# EAGLE design sparkfun_esp32_environment_sensor_shield (EAGLE 7.7.0)
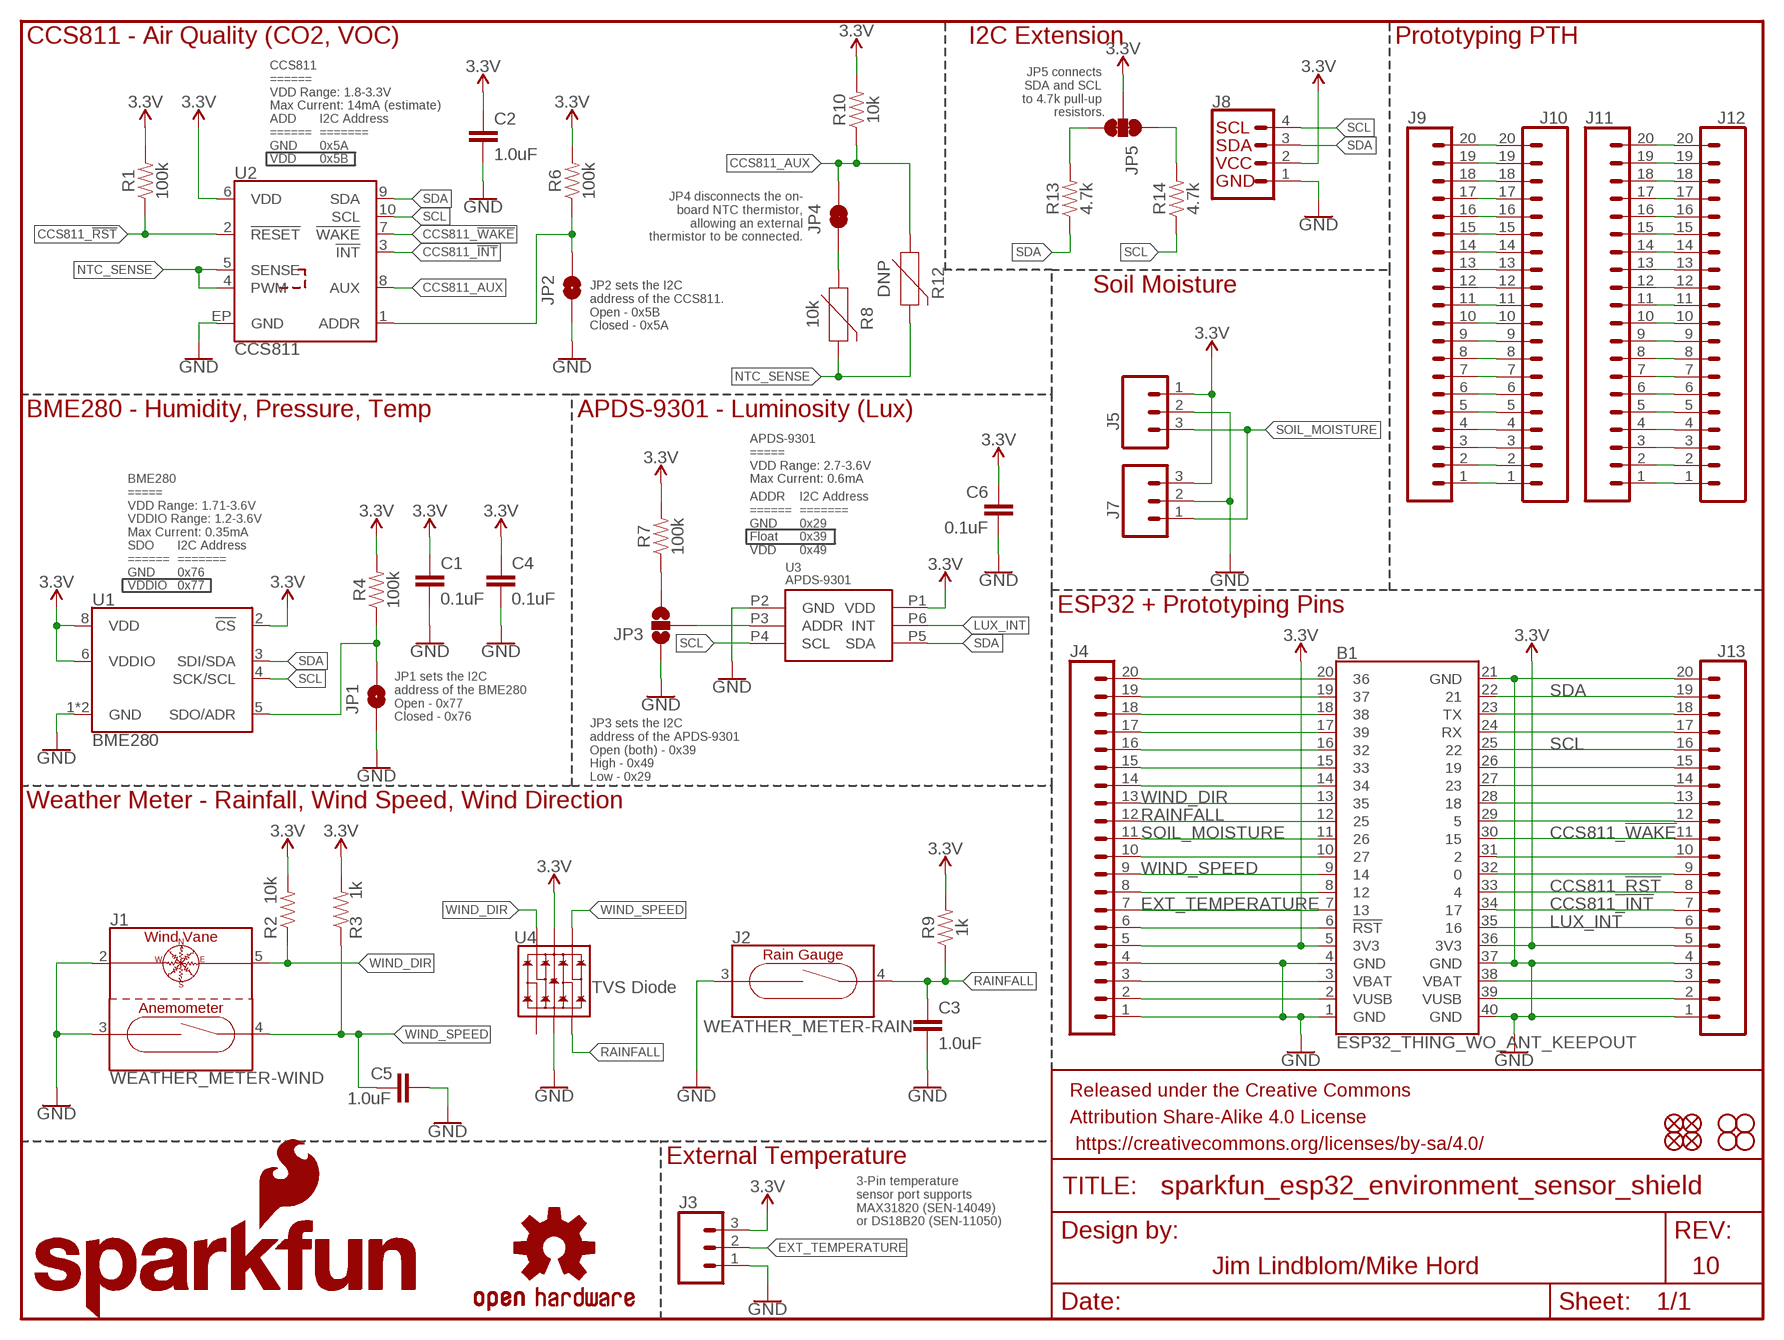
[diagram p0: schematic, sheet 1]

## Parts
B1  ESP32_THING_WO_ANT_KEEPOUT  [ESP32_THING_NO_ANT]
C1  0.1uF  0.1UF-0603-25V-(+80/-20%)  [0603]
C2  1.0uF  1.0UF-0603-16V-10%  [0603]
C3  1.0uF  1.0UF-0603-16V-10%  [0603]
C4  0.1uF  0.1UF-0603-25V-(+80/-20%)  [0603]
C5  1.0uF  1.0UF-0603-16V-10%  [0603]
C6  0.1uF  0.1UF-0603-25V-(+80/-20%)  [0603]
FD1  FIDUCIAL1X2  [FIDUCIAL-1X2]
FD2  FIDUCIAL1X2  [FIDUCIAL-1X2]
FD3  FIDUCIAL1X2  [FIDUCIAL-1X2]
FD4  FIDUCIAL1X2  [FIDUCIAL-1X2]
FRAME1  FRAME-LETTER  [CREATIVE_COMMONS]
H1  STAND-OFF  [STAND-OFF]
H2  STAND-OFF  [STAND-OFF]
H3  STAND-OFF  [STAND-OFF]
H4  STAND-OFF  [STAND-OFF]
J1  WEATHER_METER-WIND  [RJ11-6]
J2  WEATHER_METER-RAIN  [RJ11-6]
J3  CONN_03  [1X03]
J4  CONN_20NOSILK  [1X20_NOSILK]
J5  CONN_03  [1X03]
J7  CONN_03SCREW-NS  [SCREWTERMINAL-3.5MM-3-NS]
J8  I2C_STANDARD  [1X04]
J9  CONN_20NOSILK  [1X20_NOSILK]
J10  CONN_20NOSILK  [1X20_NOSILK]
J11  CONN_20NOSILK  [1X20_NOSILK]
J12  CONN_20NOSILK  [1X20_NOSILK]
J13  CONN_20NOSILK  [1X20_NOSILK]
JP1  JUMPER-SMT_2_NO_SILK  [SMT-JUMPER_2_NO_SILK]
JP2  JUMPER-SMT_2_NO_SILK  [SMT-JUMPER_2_NO_SILK]
JP3  JUMPER-SMT_3_NO_SILK  [SMT-JUMPER_3_NO_SILK]
JP4  JUMPER-SMT_2_NC_TRACE_SILK  [SMT-JUMPER_2_NC_TRACE_SILK]
JP5  JUMPER-SMT_3_2-NC_TRACE_SILK  [SMT-JUMPER_3_2-NC_TRACE_SILK]
LOGO1  SFE_LOGO_NAME.1_INCH  [SFE_LOGO_NAME_.1]
LOGO2  SFE_LOGO_NAME_FLAME.1_INCH  [SFE_LOGO_NAME_FLAME_.1]
LOGO3  SFE_LOGO_FLAME.1_INCH  [SFE_LOGO_FLAME_.1]
LOGO4  OSHW-LOGOS  [OSHW-LOGO-S]
R1  100k  100KOHM-0603-1/10W-1%  [0603]
R2  10k  10KOHM-0603-1/10W-1%  [0603]
R3  1k  1KOHM-0603-1/10W-1%  [0603]
R4  100k  100KOHM-0603-1/10W-1%  [0603]
R6  100k  100KOHM-0603-1/10W-1%  [0603]
R7  100k  100KOHM-0603-1/10W-1%  [0603]
R8  10k  NTC-THERMISTOR-0603  [0603]
R9  1k  1KOHM-0603-1/10W-1%  [0603]
R10  10k  10KOHM-0603-1/10W-1%  [0603]
R12  DNP  NTC-THERMISTOR-AXIAL-0.1  [AXIAL-0.1]
R13  4.7k  4.7KOHM-0603-1/10W-1%  [0603]
R14  4.7k  4.7KOHM-0603-1/10W-1%  [0603]
U1  BME280  [LGA-8-2.5X2.5]
U2  CCS811  [LGA10-2.7X4.0MM]
U3  APDS-9301  [CHIPLED-6]
U4  TVS Diode  TVS_DIODE_ARRAYSMD  [SOT-23-6]

## Nets
3.3V: B1.5(3V3) B1.36(3V3) C1.1 C2.1 C4.1 C6.1 J3.3 J4.5 J5.1 J7.3 J8.2 J13.5 JP5.2 R1.2 R2.2 R3.2 R4.2 R6.2 R7.2 R9.2 R10.2 U1.2(!CS) U1.6(VDDIO) U1.8(VDD) U2.6(VDD) U3.P1(VDD) U4.5(VCC)
ADDR_TSL2561: JP3.2 U3.P3(ADDR)
CCS811_!INT!: B1.34 J13.7 U2.3(!INT!)
CCS811_!RST!: B1.33 J13.8 R1.1 U2.2(!RESET!)
CCS811_!WAKE!: B1.30 J13.11 U2.7(!WAKE!)
CCS811_ADDR: JP2.2 R6.1 U2.1(ADDR)
CCS811_AUX: JP4.2 R10.1 R12.P$1 U2.8(AUX)
EXT_TEMPERATURE: B1.7 J3.2 J4.7
GND: B1.1(GND) B1.4(GND) B1.21(GND) B1.37(GND) B1.40(GND) C1.2 C2.2 C3.2 C4.2 C5.2 C6.2 J1.2(DIR-1) J1.3(ANN-1) J2.3 J3.1 J4.1 J4.4 J5.2 J7.2 J8.1 J13.1 J13.4 J13.20 JP1.1 JP2.1 JP3.1 U1.1(GND) U1.7(GND) U2.EP(GND) U3.P2(GND) U4.2(VSS)
LUX_INT: B1.35 J13.6 U3.P6(INT)
N$1: JP3.3 R7.1
N$2: JP1.2 R4.1 U1.5(SDO/ADR)
N$3: JP4.1 R8.1
N$4: JP5.3 R13.2
N$5: JP5.1 R14.2
N$6: B1.2(VUSB) J4.2
N$7: B1.3(VBAT) J4.3
N$8: B1.6(!RST!) J4.6
N$9: B1.10 J4.10
N$11: B1.14 J4.14
N$12: B1.15 J4.15
N$13: B1.16 J4.16
N$14: B1.17 J4.17
N$15: B1.18 J4.18
N$16: B1.19 J4.19
N$17: B1.20 J4.20
N$18: B1.39(VUSB) J13.2
N$19: B1.38(VBAT) J13.3
N$20: B1.32 J13.9
N$21: B1.31 J13.10
N$22: B1.8 J4.8
N$23: B1.29 J13.12
N$24: B1.28 J13.13
N$25: B1.27 J13.14
N$26: B1.26 J13.15
N$27: B1.24(RX) J13.17
N$28: B1.23(TX) J13.18
N$29: J11.1 J12.1
N$30: J11.2 J12.2
N$31: J11.3 J12.3
N$32: J11.4 J12.4
N$33: J11.5 J12.5
N$34: J11.6 J12.6
N$35: J11.7 J12.7
N$36: J11.8 J12.8
N$37: J11.9 J12.9
N$38: J11.10 J12.10
N$39: J11.11 J12.11
N$40: J11.12 J12.12
N$41: J11.13 J12.13
N$42: J11.14 J12.14
N$43: J11.15 J12.15
N$44: J11.16 J12.16
N$45: J11.17 J12.17
N$46: J11.18 J12.18
N$47: J11.19 J12.19
N$48: J11.20 J12.20
N$49: J9.1 J10.1
N$50: J9.2 J10.2
N$51: J9.3 J10.3
N$52: J9.4 J10.4
N$53: J9.5 J10.5
N$54: J9.6 J10.6
N$55: J9.7 J10.7
N$56: J9.8 J10.8
N$57: J9.9 J10.9
N$58: J9.10 J10.10
N$59: J9.11 J10.11
N$60: J9.12 J10.12
N$61: J9.13 J10.13
N$62: J9.14 J10.14
N$63: J9.15 J10.15
N$64: J9.16 J10.16
N$65: J9.17 J10.17
N$66: J9.18 J10.18
N$67: J9.19 J10.19
N$68: J9.20 J10.20
NTC_SENSE: R8.2 R12.P$2 U2.4(PWM) U2.5(SENSE)
RAINFALL: B1.12 C3.1 J2.4 J4.12 R9.1 U4.3(IO2)
SCL: B1.25 J8.4 J13.16 R14.1 U1.4(SCK/SCL) U2.10(SCL) U3.P4(SCL)
SDA: B1.22 J8.3 J13.19 R13.1 U1.3(SDI/SDA) U2.9(SDA) U3.P5(SDA)
SOIL_MOISTURE: B1.11 J4.11 J5.3 J7.1
WIND_DIR: B1.13 J1.5(DIR2) J4.13 R2.1 U4.6(IO4)
WIND_SPEED: B1.9 C5.1 J1.4(ANN-2) J4.9 R3.1 U4.4(IO3)
Unconnected: U4.1(IO1)

## Notes on the sheet
- CCS811 - Air Quality (CO2, VOC) | I2C Extension | Prototyping PTH
- JP5 connects 
  SDA and SCL 
  to 4.7k pull-up 
  resistors.
- CCS811
  ======
  VDD Range: 1.8-3.3V
  Max Current: 14mA (estimate)
- ADD
  ======
  GND
  VDD
- I2C Address
  =======
  0x5A
  0x5B
- JP4 disconnects the on-
  board NTC thermistor,
  allowing an external
  thermistor to be connected.
- Soil Moisture
- JP2 sets the I2C 
  address of the CCS811.
  Open - 0x5B
  Closed - 0x5A
- BME280 - Humidity, Pressure, Temp | APDS-9301 - Luminosity (Lux)
- APDS-9301
  =====
  VDD Range: 2.7-3.6V
  Max Current: 0.6mA
- BME280
  =====
  VDD Range: 1.71-3.6V
  VDDIO Range: 1.2-3.6V
  Max Current: 0.35mA
- ADDR
  ======
  GND
  Float
  VDD
- I2C Address
  =======
  0x29
  0x39
  0x49
- SDO
  ======
  GND
  VDDIO
- I2C Address
  =======
  0x76
  0x77
- ESP32 + Prototyping Pins
- JP1 sets the I2C 
  address of the BME280
  Open - 0x77
  Closed - 0x76
- JP3 sets the I2C 
  address of the APDS-9301
  Open (both) - 0x39
  High - 0x49
  Low - 0x29
- Weather Meter - Rainfall, Wind Speed, Wind Direction
- External Temperature
- 3-Pin temperature 
  sensor port supports
  MAX31820 (SEN-14049)
  or DS18B20 (SEN-11050)
- Jim Lindblom/Mike Hord | 10

## Library data of the parts
B1 = SparkFun-Boards:ESP32_THING: SparkFun ESP32 Thing Board Pins, silkscreen, and logos matching the layout of the SparkFun ESP32 Thing <https://www.sparkfun.com/products/13907> Dimensions: 2.32" x 1.00"
C1 C4 C6 = SparkFun-Capacitors:0.1UF: 0.1µF ceramic capacitors A capacitor is a passive two-terminal electrical component used to store electrical energy temporarily in an electric field.; PROD_ID: CAP-00810
C2 C3 C5 = SparkFun-Capacitors:1.0UF: 1µF ceramic capacitors A capacitor is a passive two-terminal electrical component used to store electrical energy temporarily in an electric field.; PROD_ID: CAP-00868
FD1-FD4 = SparkFun-Aesthetics:FIDUCIAL: Fiducial Alignment Points Point-of-reference for pick-and-place machines and other optical instruments.
FRAME1 = SparkFun-Aesthetics:FRAME-LETTER: Schematic Frame - Letter Standard 8.5x11 US Letter frame
H1-H4 = SparkFun-Hardware:STAND-OFF: Stand Off Drill holes for mechanically mounting via screws, standoffs, etc. Note: Use the keepout ring to avoid running the screw head into surrounding components. Variant Overviews STAND-OFF - Mechanical footprint for a #4 phillips button head screw. STAND-OFF-TIGHT - Mechanical footprint for a #4 phillips button head screw, Example SparkFun Products Screw - Phillips Head (1/4", 4-40, 10 pack) <https://www.sparkfun.com/products/10453> (PRT-10453) Screw - Phillips Head (1/2", 4-40, 10 pack) <https://www.sparkfun.com/products/10452> (PRT-10452) Screw - Phillips Head (3/4", 4-40, 10 pack) <https://www.sparkfun.com/products/10451> (PRT-10451) Screw - Phillips Head (1", 4-40, 10 pack) <https://www.sparkfun.com/products/10450> (PRT-10450)
J1 = esp32-environ-monitor-temp:WEATHER_METER-WIND: RJ11 Jack - 6 pin Commonly found on CAT3 devices and some Microchip programmers. Here is the connector we sell at SparkFun: RJ11 6-Pin Connector <https://www.sparkfun.com/products/132> (PRT-00132) Datasheet <http://www.sparkfun.com/datasheets/Prototyping/Connectors/RJ11-Datasheet.pdf> It is used on this SparkFun product: SparkFun Weather Shield <https://www.sparkfun.com/products/12081> (DEV-12081) Weather Meters <https://www.sparkfun.com/products/8942> (SEN-08942); PROD_ID: CONN-08590; SF_ID: PRT-00132
J2 = esp32-environ-monitor-temp:WEATHER_METER-RAIN: Weather Meter - Rain Gauge Symbol The rain half of the SparkFun Weather Meter <https://www.sparkfun.com/products/8942>. The rain gauge is a self-emptying tipping bucket type. Each 0.011” (0.2794 mm) of rain causes one momentary contact closure that can be recorded with a digital counter or microcontroller interrupt input. The gauge’s switch is connected to the two center conductors of the attached RJ11-terminated cable. Datasheet <http://www.sparkfun.com/datasheets/Sensors/Weather/Weather%20Sensor%20Assembly..pdf> Here is the connector we sell at SparkFun: RJ11 6-Pin Connector <https://www.sparkfun.com/products/132> (PRT-00132) Datasheet <http://www.sparkfun.com/datasheets/Prototyping/Connectors/RJ11-Datasheet.pdf> It is used on this SparkFun product: SparkFun Weather Shield <https://www.sparkfun.com/products/12081> (DEV-12081) Weather Meters <https://www.sparkfun.com/products/8942> (SEN-08942); PROD_ID: CONN-08590; SF_ID: SEN-08942
J3 J5 J7 = SparkFun-Connectors:CONN_03: Multi connection point. Often used as Generic Header-pin footprint for 0.1 inch spaced/style header connections On any of the 0.1 inch spaced packages, you can populate with these: Break Away Headers - Straight <https://www.sparkfun.com/products/116> (PRT-00116) Break Away Male Headers - Right Angle <https://www.sparkfun.com/products/553> (PRT-00553) Female Headers <https://www.sparkfun.com/products/115> (PRT-00115) Break Away Headers - Machine Pin <https://www.sparkfun.com/products/117> (PRT-00117) Break Away Female Headers - Swiss Machine Pin <https://www.sparkfun.com/products/743> (PRT-00743) Stackable Header - 3 Pin (Female, 0.1") <https://www.sparkfun.com/products/13875> (PRT-13875) For SCREWTERMINALS and SPRING TERMINALS visit here: Screw Terimnals on SparkFun.com <https://www.sparkfun.com/search/results?term=Screw+Terminals> (5mm/3.5mm/2.54mm spacing) This device is also useful as a general connection point to wire up your design to another part of your project. Our various solder wires solder well into these plated through hole pads. Hook-Up Wire - Assortment (Stranded, 22 AWG) <https://www.sparkfun.com/products/11375> (PRT-11375) Hook-Up Wire - Assortment (Solid Core, 22 AWG) <https://www.sparkfun.com/products/11367> (PRT-11367) View the entire wire category on our website here <https://www.sparkfun.com/categories/141> Special notes: Molex polarized connector foot print use with SKU : PRT-08232 with associated crimp pins and housings.
J4 J9-J13 = SparkFun-Connectors:CONN_20: Multi connection point. Often used as Generic Header-pin footprint for 0.1 inch spaced/style header connections On any of the 0.1 inch spaced packages, you can populate with these: Break Away Headers - Straight <https://www.sparkfun.com/products/116> (PRT-00116) Break Away Male Headers - Right Angle <https://www.sparkfun.com/products/553> (PRT-00553) Female Headers <https://www.sparkfun.com/products/115> (PRT-00115) Break Away Headers - Machine Pin <https://www.sparkfun.com/products/117> (PRT-00117) Break Away Female Headers - Swiss Machine Pin <https://www.sparkfun.com/products/743> (PRT-00743) For SCREWTERMINALS and SPRING TERMINALS visit here: Screw Terimnals on SparkFun.com <https://www.sparkfun.com/search/results?term=Screw+Terminals> (5mm/3.5mm/2.54mm spacing) This device is also useful as a general connection point to wire up your design to another part of your project. Our various solder wires solder well into these plated through hole pads. Hook-Up Wire - Assortment (Stranded, 22 AWG) <https://www.sparkfun.com/products/11375> (PRT-11375) Hook-Up Wire - Assortment (Solid Core, 22 AWG) <https://www.sparkfun.com/products/11367> (PRT-11367) View the entire wire category on our website here <https://www.sparkfun.com/categories/141> Special notes: Molex polarized connector foot print use with SKU : PRT-08231 with associated crimp pins and housings. 1MM SMD Version SKU: PRT-10208 NOTES ON THE VARIANTS LOCK and LOCK_LONGPADS... This footprint was designed to help hold the alignment of a through-hole component (i.e. 6-pin header) while soldering it into place. You may notice that each hole has been shifted either up or down by 0.005 of an inch from it's more standard position (which is a perfectly straight line). This slight alteration caused the pins (the squares in the middle) to touch the edges of the holes. Because they are alternating, it causes a "brace" to hold the component in place. 0.005 has proven to be the perfect amount of "off-center" position when using our standard breakaway headers. Although looks a little odd when you look at the bare footprint, once you have a header in there, the alteration is very hard to notice. Also,if you push a header all the way into place, it is covered up entirely on the bottom side. Note about LOCK SPECIAL package: This is just like the LOCK variant in that the holes are staggared by 5 mil, but except for the last two holes. They are not altered from the "standard" footprint layout. This is used for a special purpose on the layout of our Graphic LCD Backpack. Make sure you want to use this device before selecting it for you project!
J8 = SparkFun-Connectors:I2C_STANDARD: SparkFun I2C Standard Pinout Header SparkFun has standardized on a pinout for all I2C based sensor breakouts. This pinout allows I2C boards to be plugged directly into the headers on Arduino Uno compatible boards, and to be daisy chained easily. Example SparkFun Products: SparkFun Atmospheric Sensor Breakout - BME280 <https://www.sparkfun.com/products/13676> SparkFun Altitude/Pressure Sensor Breakout - MPL3115A2 <https://www.sparkfun.com/products/11084> SparkFun TOF Range Finder Sensor - VL6180 <https://www.sparkfun.com/products/12785>
JP1 JP2 = SparkFun-Jumpers:JUMPER-SMT_2_NO: Normally open jumper This jumper has two pads in close proximity to each other. Apply solder to close the connection. Round pads are easier to solder for beginners, but are a lot larger. SparkFun Product that uses the round pads: SparkFun EL Sequencer <https://www.sparkfun.com/products/12781>
JP3 = SparkFun-Jumpers:JUMPER-SMT_3_NO: Normally open jumper This jumper has three pads in close proximity to each other. Apply solder to close the connection(s).
JP4 = SparkFun-Jumpers:JUMPER-SMT_2_NC_TRACE: Normally closed trace jumper This jumper has a trace between two pads so it's normally closed (NC). Use a razor knife to open the connection. For best results follow the IPC guidelines for cutting traces: Cutout at least 0.063 mm (0.005 in). Remove all loose material to clean up the cut area. Seal the cut with an approved epoxy. Reapply solder to reclose the connection.
JP5 = SparkFun-Jumpers:JUMPER-SMT_3_2-NC_TRACE: Normally closed trace jumper (2 of 2 connections) This jumper has a trace between all three pads so they are normally closed (NC). Use a razor knife to open the connection(s). For best results follow the IPC guidelines for cutting traces: Cutout at least 0.063 mm (0.005 in). Remove all loose material to clean up the cut area. Seal the cut with an approved epoxy. Reapply solder to reclose the connection(s).
LOGO1 = SparkFun-Aesthetics:SFE_LOGO_NAME: SparkFun Font Logo This is the SparkFun name logo. The logo on the schematic will always be the same size; the package variant is the height of the flame part of the logo (or the height the flame would be, if it were drawn). Default layer for the logo on the board is tSilk.
LOGO2 = SparkFun-Aesthetics:SFE_LOGO_NAME_FLAME: SparkFun Font Logo w/ Flame This is the SparkFun full logo. The logo on the schematic will always be the same size; the package variant is the height of the flame part of the logo. Default layer for the logo on the board is tSilk.
LOGO3 = SparkFun-Aesthetics:SFE_LOGO_FLAME: SparkFun Flame Logo This is the SparkFun flame logo. The logo on the schematic will always be the same size; the package variant is the height of the flame. Default layer for the logo on the board is tSilk.
LOGO4 = SparkFun-Aesthetics:OSHW-LOGO: Open-Source Hardware (OSHW) Logo This logo indicates the piece of hardware it is found on incorporates a OSHW license and/or adheres to the definition of open source hardware found here: http://freedomdefined.org/OSHW
R1 R4 R6 R7 = SparkFun-Resistors:100KOHM: 100kΩ resistor A resistor is a passive two-terminal electrical component that implements electrical resistance as a circuit element. Resistors act to reduce current flow, and, at the same time, act to lower voltage levels within circuits. - Wikipedia; PROD_ID: RES-07828
R2 R10 = SparkFun-Resistors:10KOHM: 10kΩ resistor A resistor is a passive two-terminal electrical component that implements electrical resistance as a circuit element. Resistors act to reduce current flow, and, at the same time, act to lower voltage levels within circuits. - Wikipedia; PROD_ID: RES-00824
R3 R9 = SparkFun-Resistors:1KOHM: 1kΩ resistor A resistor is a passive two-terminal electrical component that implements electrical resistance as a circuit element. Resistors act to reduce current flow, and, at the same time, act to lower voltage levels within circuits. - Wikipedia; PROD_ID: RES-07856
R8 = esp32-environ-monitor-temp:NTC-THERMISTOR: NTC Thermistor An NTC thermistor's resistance decreases as temperature rises. Applications: Resistance Thermometer - temperature monitoring Inrush current limiter Heat source; PROD_ID: RES-13608
R12 = esp32-environ-monitor-temp:NTC-THERMISTOR: NTC Thermistor An NTC thermistor's resistance decreases as temperature rises. Applications: Resistance Thermometer - temperature monitoring Inrush current limiter Heat source; SF_ID: SEN-00250; VALUE: 10k
R13 R14 = SparkFun-Resistors:4.7KOHM: 4.7kΩ resistor A resistor is a passive two-terminal electrical component that implements electrical resistance as a circuit element. Resistors act to reduce current flow, and, at the same time, act to lower voltage levels within circuits. - Wikipedia; PROD_ID: RES-07857
U1 = SparkFun-Sensors:BME280: Bosch BME280 – Combined Humidity and Pressure Sensor The BME280 is as combined digital humidity, pressure and temperature sensor based on proven sensing principles. The sensor module is housed in an extremely compact metal-lid LGA package with a footprint of only 2.5×2.5mm² with a height of 0.93mm. Its small dimensions and its low power consumption allow the implementation in battery driven devices such as handsets, GPS modules or watches. Datasheet <https://cdn.sparkfun.com/assets/learn_tutorials/4/1/9/BST-BME280_DS001-10.pdf> SparkFun Products SparkFun Atmospheric Sensor Breakout - BME280 <https://www.sparkfun.com/products/13676> (SEN-13676); PROD_ID: IC-13090
U2 = esp32-environ-monitor-temp:CCS811: AMS CCS811 – I2C Digital Gas Sensor Ultra-Low Power Digital Gas Sensor for Monitoring Indoor Air Quality AMS Product Page <http://ams.com/eng/Products/Environmental-Sensors/Gas-Sensors/CCS811> SparkFun Products:; PROD_ID: IC-13607
U3 = SparkFun-Sensors:APDS-9301; PROD_ID: IC-13662
U4 = esp32-environ-monitor-temp:TVS_DIODE_ARRAY; PROD_ID: IC-13538; VALUE: ESD Diode

## Board
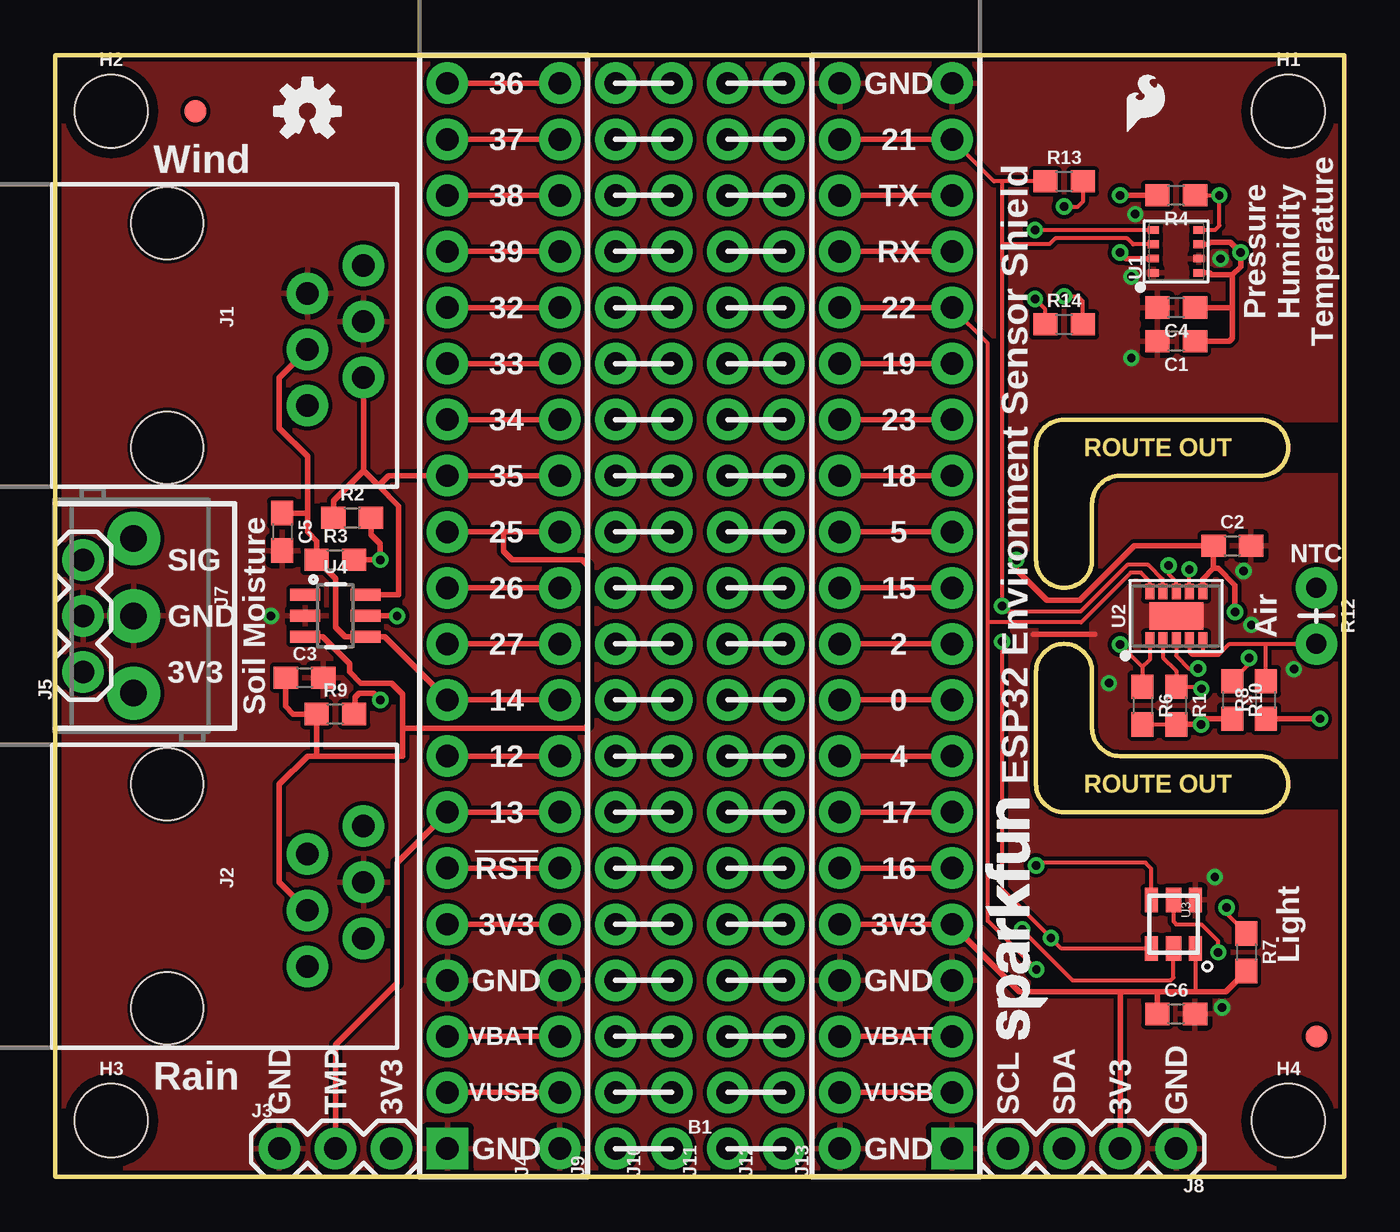
[diagram p1: board, top side]
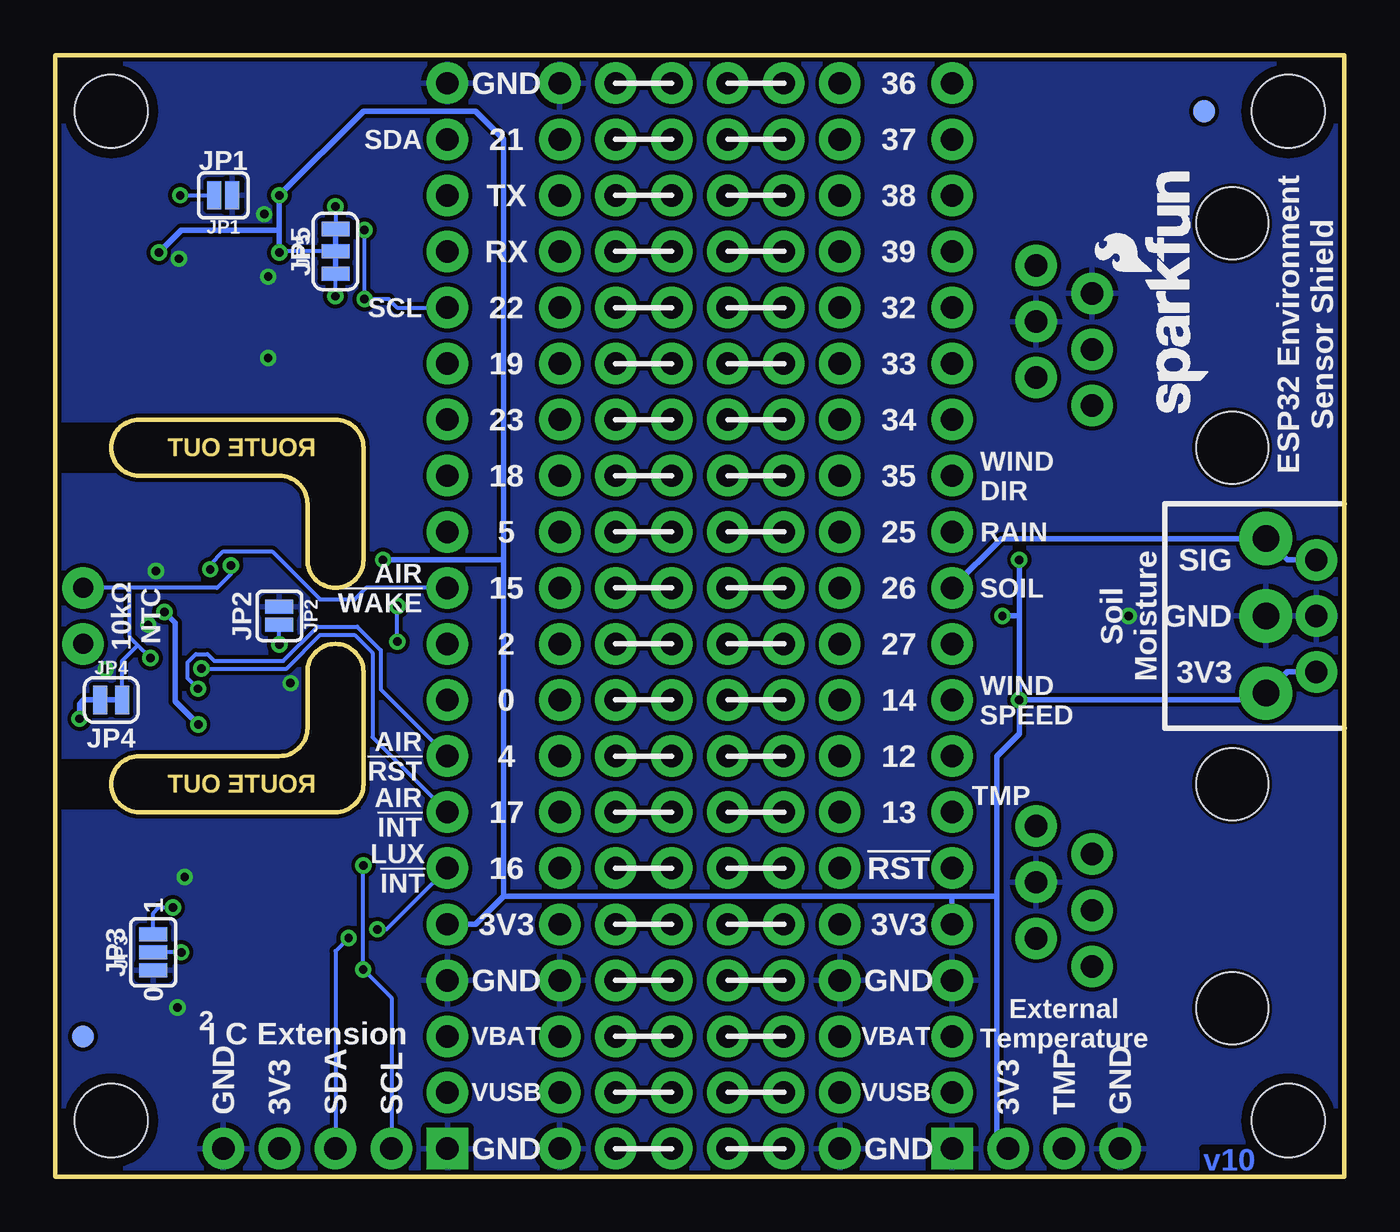
[diagram p2: board, bottom side, seen from below]

Size 58.42 x 50.8 mm. Coordinates in mm from the lower left corner, seen from the top.
Outline: 0,0 0,50.8 58.42,50.8 58.42,0 0,0
Outline: 45.72,34.29 arc90 44.45,33.02 44.45,27.94 arc90 45.72,26.67 arc90 46.99,27.94 46.99,30.48 arc-90 48.26,31.75 54.61,31.75 arc90 55.88,33.02 arc90 54.61,34.29 45.72,34.29
Outline: 44.45,17.78 arc90 45.72,16.51 54.61,16.51 arc90 55.88,17.78 arc90 54.61,19.05 48.26,19.05 arc-90 46.99,20.32 46.99,22.86 arc90 45.72,24.13 arc90 44.45,22.86 44.45,17.78
Copper layers (1*16): Top 0.035mm / dielectric 1.5mm / Bottom 0.035mm
Design rules "SparkFun-2-layer-TIGHT": minimum track width 7mil, minimum drill 15mil, track to track 7mil, track to pad 7mil, pad to pad 7mil, via to via 7mil, smd to smd 7mil, copper to edge 7mil, drill to drill 7mil, minimum pad ring 7mil, minimum via ring 7mil, stop-mask expansion 4mil, vias tented up to drill 25mil, thermal gap 10mil
Milling: area 44.5,26.7 to 55.9,34.3; area 44.5,16.5 to 55.9,24.1

### Footprints (pad centres in the part's own frame; a part is rotated, then mirrored left to right if it is on the bottom)
ESP32_THING_NO_ANT = drill 1.016 pad 1.88 square: 1 1.27,1.27; 40 24.13,1.27 | drill 1.016 pad 1.88: 2 1.27,3.81; 3 1.27,6.35; 4 1.27,8.89; 5 1.27,11.43; 6 1.27,13.97; 7 1.27,16.51; 8 1.27,19.05; 9 1.27,21.59; 10 1.27,24.13; 11 1.27,26.67; 12 1.27,29.21; 13 1.27,31.75; 14 1.27,34.29; 15 1.27,36.83; 16 1.27,39.37; 17 1.27,41.91; 18 1.27,44.45; 19 1.27,46.99; 20 1.27,49.53; 21 24.13,49.53; 22 24.13,46.99; 23 24.13,44.45; 24 24.13,41.91; 25 24.13,39.37; 26 24.13,36.83; 27 24.13,34.29; 28 24.13,31.75; 29 24.13,29.21; 30 24.13,26.67; 31 24.13,24.13; 32 24.13,21.59; 33 24.13,19.05; 34 24.13,16.51; 35 24.13,13.97; 36 24.13,11.43; 37 24.13,8.89; 38 24.13,6.35; 39 24.13,3.81
0603 = smd 1.1 x 1: 1 -0.85,0; 2 0.85,0
FIDUCIAL-1X2 = smd 1 x 1: 1 0,0
STAND-OFF = hole 3.302: 0,0
RJ11-6 = drill 1.016 pad 1.88: 1 -3.175,8.89; 2 -1.905,6.35; 3 -0.635,8.89; 4 0.635,6.35; 5 1.905,8.89; 6 3.175,6.35 | hole 3.251: -5.08,0; 5.08,0
1X03 = drill 1.016 pad 1.88: 1 0,0; 2 2.54,0; 3 5.08,0
1X20_NOSILK = drill 1.016 pad 1.88: 1 0,0; 2 2.54,0; 3 5.08,0; 4 7.62,0; 5 10.16,0; 6 12.7,0; 7 15.24,0; 8 17.78,0; 9 20.32,0; 10 22.86,0; 11 25.4,0; 12 27.94,0; 13 30.48,0; 14 33.02,0; 15 35.56,0; 16 38.1,0; 17 40.64,0; 18 43.18,0; 19 45.72,0; 20 48.26,0
SCREWTERMINAL-3.5MM-3-NS = drill 1.2 pad 2.413: 1 0,0; 2 3.5,0; 3 7,0
1X04 = drill 1.016 pad 1.88: 1 0,0; 2 2.54,0; 3 5.08,0; 4 7.62,0
SMT-JUMPER_2_NO_SILK = smd 0.635 x 1.27: 1 -0.406,0; 2 0.406,0
SMT-JUMPER_3_NO_SILK = smd 0.635 x 1.27: 1 -0.813,0; 2 0,0; 3 0.813,0
SMT-JUMPER_2_NC_TRACE_SILK = smd 0.635 x 1.27: 1 -0.508,0; 2 0.508,0
SMT-JUMPER_3_2-NC_TRACE_SILK = smd 0.635 x 1.27: 1 -1.016,0; 2 0,0; 3 1.016,0
AXIAL-0.1 = drill 0.9 pad 1.88: P$1 -1.27,0; P$2 1.27,0
LGA-8-2.5X2.5 = smd 0.35 x 0.5: 1 -0.975,1.025; 2 -0.325,1.025; 3 0.325,1.025; 4 0.975,1.025; 5 0.975,-1.025; 6 0.325,-1.025; 7 -0.325,-1.025; 8 -0.975,-1.025
LGA10-2.7X4.0MM = smd 0.7 x 0.4: 1 -1.1,1.2; 2 -1.1,0.6; 3 -1.1,0; 4 -1.1,-0.6; 5 -1.1,-1.2; 6 1.1,-1.2; 7 1.1,-0.6; 8 1.1,0; 9 1.1,0.6; 10 1.1,1.2 | smd 1.25 x 2.45: EP 0,0
CHIPLED-6 = smd 1.1 x 0.6: P1 1.1,1; P2 -1.1,1; P4 -1.1,-1; P5 1.1,-1 | smd 1.1 x 0.7: P3 -1.1,0; P6 1.1,0
SOT-23-6 = smd 0.55 x 1.35: 1 -0.95,-1.375; 2 0,-1.375; 3 0.95,-1.375; 4 0.95,1.375; 5 0,1.375; 6 -0.95,1.375

### Placement (x,y rotation side)
B1  16.51,0 0 top
C1  50.8,37.85 180 top
C2  53.34,28.57 0 top
C3  11.3,22.61 0 top
C4  50.8,39.37 180 top
C5  10.29,29.21 270 top
C6  50.8,7.37 0 top
FD1  6.35,48.26 0 top
FD2  57.15,6.35 0 top
FD3  57.15,6.35 0 bottom
FD4  6.35,48.26 0 bottom
FRAME1  -13.97,-21.59 0 top  (outside the outline)
H1  55.88,48.26 0 top
H2  2.54,48.26 0 top
H3  2.54,2.54 0 top
H4  55.88,2.54 0 top
J1  5.08,38.1 270 top
J2  5.08,12.7 270 top
J3  10.16,1.27 0 top
J4  22.86,1.27 90 top
J5  1.27,22.86 90 top
J7  3.56,28.9 270 top
J8  50.8,1.27 180 top
J9  25.4,1.27 90 top
J10  27.94,1.27 90 top
J11  30.48,1.27 90 top
J12  33.02,1.27 90 top
J13  35.56,1.27 90 top
JP1  50.8,44.45 180 bottom
JP2  48.26,25.4 270 bottom
JP3  53.98,10.16 90 bottom
JP4  55.88,21.59 0 bottom
JP5  45.72,41.91 90 bottom
LOGO1  45.47,5.71 90 top
LOGO2  6.1,34.16 90 bottom
LOGO3  48.26,46.99 0 top
LOGO4  11.43,48.26 0 top
R1  50.8,21.34 270 top
R2  13.46,29.84 0 top
R3  12.7,27.94 0 top
R4  50.8,44.45 180 top
R6  49.28,21.34 270 top
R7  53.98,10.16 270 top
R8  54.86,21.59 90 top
R9  12.7,20.95 0 top
R10  53.34,21.59 270 top
R12  57.15,25.4 270 top
R13  45.72,45.09 0 top
R14  45.72,38.61 0 top
U1  50.8,41.91 90 top
U2  50.8,25.4 90 top
U3  50.67,11.43 270 top
U4  12.7,25.4 270 top

### Tracks (layer width: path | path; a pad name or v marks a point on that pad's centre or on a via)
3.3V  (via drill 0.38)
  Top 0.178: R6.2 R1.2 | U3.P1 51.67,8.4 51.69,8.38
  Top 0.254: U2.6 52,27.06 52.49,27.55 | R1.2 v51.93,20.49 52.19,20.74 R10.2 | 48.26,8.38 43.69,8.38 B1.36 J13.5 | 48.26,8.38 49.95,8.38 | 49.95,8.38 51.69,8.38 53.05,8.38 R7.2 | J8.2 48.26,8.38 | U1.2 48.53,41.59 v48.26,41.86 | C4.1 53.34,39.37 | 52.49,27.55 C2.1 48.9,28.57 46.43,26.11 44.93,26.11 43.56,27.48 v43.56,27.94 | 52.49,27.55 52.72,27.55 53.47,26.8 v53.47,25.58 | v48.26,44.45 R4.2 | J4.5 B1.5 | C6.1 49.95,8.38 | U1.8 52.31,40.94 52.4,40.84 53.34,40.84 | U1.6 52.24,42.23 52.32,42.32 53.26,42.32 v53.72,41.86 53.72,41.22 53.34,40.84 | R3.2 v14.73,27.94 14.73,28.66 14.31,29.08 R2.2 | v14.73,21.59 14.42,21.9 13.77,21.9 13.59,21.72 13.59,20.99 R9.2 | U4.5 v15.49,25.4 | 53.34,40.84 53.34,39.37 | 53.34,39.37 53.34,37.97 53.21,37.85 C1.1
  Bottom 0.178: JP5.2 48.21,41.91 v48.26,41.86
  Bottom 0.254: 38.1,12.7 39.37,11.43 B1.36 | B1.5 17.78,12.7 | 17.78,12.7 38.1,12.7 | 38.1,12.7 38.1,27.94 | 38.1,27.94 38.1,46.99 39.37,48.26 44.45,48.26 v48.26,44.45 48.26,42.88 | J5.1 2.6,22.86 J7.3 3.87,21.59 v14.73,21.59 | J3.3 15.75,1.78 15.75,12.7 | 15.75,12.7 15.75,19.05 14.73,20.07 v14.73,21.59 | 17.78,12.7 15.75,12.7 | v53.47,25.58 52.98,25.09 52.98,21.54 v51.93,20.49 | v48.26,41.86 48.26,42.88 | v53.72,41.86 52.7,42.88 48.26,42.88 | v43.56,27.94 38.1,27.94 | v14.73,21.59 14.73,25.4 | 14.73,25.4 v14.73,27.94 | v15.49,25.4 14.73,25.4
ADDR_TSL2561  (via drill 0.38)
  Top 0.178: v52.7,10.16 52.7,10.67 51.94,11.43 50.8,11.43 50.67,11.56 U3.P3
  Bottom 0.178: v52.7,10.16 JP3.2
CCS811_!INT!  (via drill 0.38)
  Top 0.178: U2.3 50.8,23.6 51.38,23.01 v51.79,23.01
  Top 0.254: J13.7 B1.34
  Bottom 0.178: v51.79,23.01 47.93,23.01 46.41,24.54 44.86,24.54 44.04,23.72 44.04,19.91 B1.34
CCS811_!RST!  (via drill 0.38)
  Top 0.178: U2.2 50.2,23.51 50.8,22.91 R1.1 51.85,22.19 v51.94,22.1
  Top 0.254: J13.8 B1.33
  Bottom 0.178: v51.94,22.1 52.43,22.58 52.43,23.29 52.05,23.67 51.51,23.67 51.21,23.37 48.08,23.37 46.53,24.92 44.73,24.92 43.66,23.85 43.66,22.07 B1.33
CCS811_!WAKE!  (via drill 0.38)
  Top 0.178: U2.7 v51.4,27.51
  Top 0.254: J13.11 B1.30
  Bottom 0.178: v51.4,27.51 51.4,27.72 50.8,28.32 48.59,28.32 46.42,26.15 44.84,26.15 44.32,26.67 B1.30
CCS811_ADDR  (via drill 0.38)
  Top 0.178: U2.1 49.6,23.41 49.28,23.09 | 49.28,23.09 R6.1 | 49.28,23.09 v48.26,24.11
  Bottom 0.178: v48.26,24.11 JP2.2
CCS811_AUX  (via drill 0.38)
  Top 0.178: v50.46,27.69 50.46,27.29 50.8,26.95 U2.8 | R10.1 54.1,23.2 v54.1,23.5
  Bottom 0.178: 55.04,26.67 51.08,26.67 50.46,27.29 v50.46,27.69 | 55.04,26.67 R12.P$1 | v54.1,23.5 54.67,24.07 | 54.67,24.07 55.04,24.43 55.04,26.67 | JP4.2 55.37,23.37 54.67,24.07
EXT_TEMPERATURE
  Top 0.254: J3.2 12.7,5.97 15.49,8.76 15.49,14.22 B1.7 J4.7
GND  (via drill 0.38)
  Top 0.254: 44.32,24.56 47.12,24.56
  other vias: 47.75,22.35 53.85,27.43 56.13,22.99 54.2,24.99 48.77,40.77 52.81,41.58 48.95,43.6 52.88,7.66 52.55,13.58 9.78,25.4 48.77,37.08
  pour Top (isolate 0.178): 0,0 58.42,0 58.42,16.51 44.45,16.51 44.45,34.29 58.42,34.29 58.42,50.8 0,50.8
  pour Bottom (isolate 0.178): 0,50.8 58.42,50.8 58.42,34.29 44.45,34.29 44.45,16.51 58.42,16.51 58.42,0 0,0
  pour Top (isolate 0.178): 46.99,31.75 46.99,19.05 58.42,19.05 58.42,31.75
  pour Bottom (isolate 0.178): 58.42,31.75 58.42,19.05 46.99,19.05 46.99,31.75
LUX_INT  (via drill 0.38)
  Top 0.178: v43.81,11.2 43.81,11.18 46.1,8.89 50.55,8.89 50.67,9.02 U3.P6
  Top 0.254: J13.6 B1.35
  Bottom 0.178: B1.35 43.41,11.2 v43.81,11.2
N$1  (via drill 0.38)
  Top 0.178: R7.1 53.09,11.9 v53.09,12.19
  Bottom 0.178: JP3.3 53.98,11.94 53.72,12.19 v53.09,12.19
N$2  (via drill 0.38)
  Top 0.178: R4.1 v52.76,44.45 52.76,43.08 52.56,42.88 U1.5
  Bottom 0.178: v52.76,44.45 JP1.2
N$3  (via drill 0.38)
  Top 0.254: R8.1 v57.32,20.74
  Bottom 0.254: JP4.1 57.15,21.59 57.32,21.42 v57.32,20.74
N$4  (via drill 0.38)
  Top 0.178: v45.72,43.94 46.35,43.94 46.57,44.16 R13.2
  Bottom 0.178: v45.72,43.94 JP5.3
N$5  (via drill 0.38)
  Top 0.178: v45.72,39.88 46.35,39.88 46.57,39.66 R14.2
  Bottom 0.178: v45.72,39.88 JP5.1
N$6
  Top 0.254: J4.2 B1.2
N$7
  Top 0.254: J4.3 B1.3
N$8
  Top 0.254: J4.6 B1.6
N$9
  Top 0.254: J4.10 B1.10
N$11
  Top 0.254: J4.14 B1.14
N$12
  Top 0.254: J4.15 B1.15
N$13
  Top 0.254: J4.16 B1.16
N$14
  Top 0.254: J4.17 B1.17
N$15
  Top 0.254: J4.18 B1.18
N$16
  Top 0.254: J4.19 B1.19
N$17
  Top 0.254: J4.20 B1.20
N$18
  Top 0.254: J13.2 B1.39
N$19
  Top 0.254: J13.3 B1.38
N$20
  Top 0.254: J13.9 B1.32
N$21
  Top 0.254: B1.31 J13.10
N$22
  Top 0.254: B1.8 J4.8
N$23
  Top 0.254: J13.12 B1.29
N$24
  Top 0.254: J13.13 B1.28
N$25
  Top 0.254: J13.14 B1.27
N$26
  Top 0.254: J13.15 B1.26
N$27
  Top 0.254: J13.17 B1.24
N$28
  Top 0.254: J13.18 B1.23
N$29
  Bottom 0.254: J12.1 J11.1
N$30
  Bottom 0.254: J12.2 J11.2
N$31
  Bottom 0.254: J11.3 J12.3
N$32
  Bottom 0.254: J12.4 J11.4
N$33
  Bottom 0.254: J12.5 J11.5
N$34
  Bottom 0.254: J11.6 J12.6
N$35
  Bottom 0.254: J12.7 J11.7
N$36
  Bottom 0.254: J11.8 J12.8
N$37
  Bottom 0.254: J12.9 J11.9
N$38
  Bottom 0.254: J11.10 J12.10
N$39
  Bottom 0.254: J12.11 J11.11
N$40
  Bottom 0.254: J11.12 J12.12
N$41
  Bottom 0.254: J12.13 J11.13
N$42
  Bottom 0.254: J11.14 J12.14
N$43
  Bottom 0.254: J12.15 J11.15
N$44
  Bottom 0.254: J11.16 J12.16
N$45
  Bottom 0.254: J12.17 J11.17
N$46
  Bottom 0.254: J11.18 J12.18
N$47
  Bottom 0.254: J11.19 J12.19
N$48
  Bottom 0.254: J11.20 J12.20
N$49
  Bottom 0.254: J10.1 J9.1
N$50
  Bottom 0.254: J9.2 J10.2
N$51
  Bottom 0.254: J10.3 J9.3
N$52
  Bottom 0.254: J10.4 J9.4
N$53
  Bottom 0.254: J10.5 J9.5
N$54
  Bottom 0.254: J10.6 J9.6
N$55
  Bottom 0.254: J10.7 J9.7
N$56
  Bottom 0.254: J9.8 J10.8
N$57
  Bottom 0.254: J9.9 J10.9
N$58
  Bottom 0.254: J9.10 J10.10
N$59
  Bottom 0.254: J10.11 J9.11
N$60
  Bottom 0.254: J10.12 J9.12
N$61
  Bottom 0.254: J10.13 J9.13
N$62
  Bottom 0.254: J10.14 J9.14
N$63
  Bottom 0.254: J9.15 J10.15
N$64
  Bottom 0.254: J10.16 J9.16
N$65
  Bottom 0.254: J9.17 J10.17
N$66
  Bottom 0.254: J10.18 J9.18
N$67
  Bottom 0.254: J9.19 J10.19
N$68
  Bottom 0.254: J10.20 J9.20
NTC_SENSE
  Top 0.178: U2.4 51.4,23.76 51.51,23.65 52,23.65 | 52,23.65 52.73,23.65 53.21,24.13 54.86,24.13 | 54.86,24.13 R12.P$2 | R8.2 54.86,24.13 | U2.5 52,23.65
RAINFALL
  Top 0.254: 11.85,19.05 15.75,19.05 15.75,20.32 | J2.4 10.16,13.34 10.16,17.78 11.43,19.05 11.85,19.05 | 11.85,19.05 R9.1 10.79,20.95 10.45,21.3 C3.1 | 15.75,20.32 15.75,21.84 15.24,22.35 13.84,22.35 13.34,22.86 13.34,23.24 12.13,24.45 U4.3 | J4.12 20.32,29.21 | 20.32,29.21 B1.12 | 20.32,29.21 20.32,28.32 20.7,27.94 23.88,27.94 24.13,27.69 24.13,20.45 24,20.32 15.75,20.32
SCL  (via drill 0.38)
  Top 0.178: U2.10 49.6,26.96 49.2,27.36 48.74,27.36 46.49,25.11 42.27,25.11 | v44.47,9.38 42.27,11.58 42.27,25.11 | 42.27,25.11 42.27,37.74 B1.25 | v44.4,42.88 U1.4 | R14.1 44.87,39.28 v44.4,39.75 | v44.45,14.1 44.58,14.22 49.4,14.22 49.67,13.95 U3.P4
  Top 0.254: J13.16 B1.25
  Bottom 0.178: J8.4 43.18,8.1 v44.47,9.38 44.47,14.08 v44.45,14.1 | B1.25 42.93,39.37 43.31,39.75 v44.4,39.75 v44.4,42.88
SDA  (via drill 0.38)
  Top 0.178: U2.9 50.2,27.04 49.53,27.71 48.59,27.71 46.47,25.59 43.17,25.59 v42.91,25.84 42.91,42.24 | B1.22 42.55,45.09 42.91,45.09 | U1.3 48.85,42.23 48.58,42.51 45.33,42.51 45.06,42.24 42.91,42.24 | R13.1 42.91,45.09 | v42.91,24.23 42.91,13.02 v45.12,10.81 45.6,10.33 U3.P5 | 42.91,42.24 42.91,45.09
  Top 0.254: J13.19 B1.22
  Bottom 0.178: v45.12,10.81 45.72,10.21 J8.3 | v42.91,24.23 v42.91,25.84
SOIL_MOISTURE
  Top 0.254: J4.11 B1.11
  Bottom 0.254: J5.3 2.6,27.94 J7.1 15.55,28.9 B1.11
WIND_DIR
  Top 0.254: 13.97,31.96 J1.5 | 13.97,31.96 14.65,31.29 | 14.65,31.29 15.56,30.38 15.56,26.35 U4.6 | R2.1 12.61,30.61 13.97,31.96 | J4.13 B1.13 15.11,31.75 14.65,31.29
WIND_SPEED
  Top 0.254: J4.9 B1.9 14.92,24.45 U4.4 13.14,24.45 12.7,24.89 12.7,27.09 R3.1 11.85,28.79 11.43,29.21 11.43,30.1 | J1.4 10.16,36.2 10.16,33.91 11.43,32.64 11.43,30.1 | C5.1 11.39,30.06 11.43,30.1

### Text on the board
Bottom: v10
Dimension: ROUTE OUT | ROUTE OUT
tPlace: 36 | GND | 37 | 21 | Wind | 38 | TX | 39 | RX | Pressure / Humidity / Temperature | 32 | 22 | 33 | 19 | 34 | 23 | 35 | 18 | 25 | 5 | SIG | NTC | 26 | 15 | GND | Soil Moisture | Air | 27 | 2 | 3V3 | 14 | 0 | 12 | 4 | ESP32 Environment Sensor Shield | 13 | 17 | !RST! | 16 | 3V3 | 3V3 | Light | GND | GND | VBAT | VBAT | Rain | VUSB | VUSB | GND | TMP | 3V3 | SCL | SDA | 3V3 | GND | GND | GND
bPlace: 36 | GND | 37 | 21 | SDA | JP1 | 38 | TX | 39 | RX | JP5 | ESP32 Environment / Sensor Shield | 32 | 22 | SCL | 33 | 19 | 34 | 23 | WIND / DIR | 35 | 18 | RAIN | 25 | 5 | SIG | SOIL | 26 | 15 | AIR / !WAKE! | GND | Soil / Moisture | JP2 | 10kΩ / NTC | 27 | 2 | 3V3 | WIND / SPEED | 14 | 0 | JP4 | 12 | 4 | AIR / !RST! | TMP | 13 | 17 | AIR / !INT! | !RST! | 16 | LUX / !INT! | 1 | 3V3 | 3V3 | JP3 | GND | GND | 0 | 2 | External / Temperature | VBAT | VBAT | I C Extension | VUSB | VUSB | GND | TMP | 3V3 | SCL | SDA | 3V3 | GND | GND | GND
Measures: Units in inches
tDocu: Jim Lindblom/Mike Hord